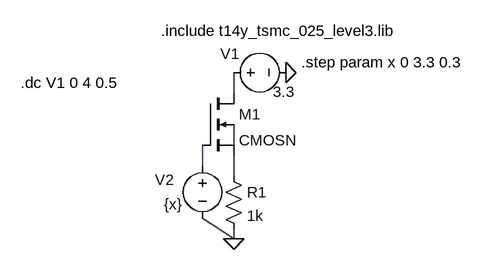
[diagram p0: schematic Draft5.asc]
Draft5.asc, the LTspice schematic file:
Version 4
SHEET 1 880 680
WIRE 176 128 176 96
WIRE 176 208 176 176
WIRE 128 240 128 208
WIRE 176 256 176 224
WIRE 176 352 128 320
WIRE 176 352 176 336
FLAG 176 352 0
FLAG 256 96 0
SYMBOL nmos4 128 128 R0
SYMATTR InstName M1
SYMATTR Value CMOSN
SYMATTR Value2 l=250n w=10u m=40
SYMBOL voltage 160 96 R270
WINDOW 0 13 10 VTop 2
WINDOW 3 -14 93 VBottom 2
WINDOW 123 0 0 Left 0
WINDOW 39 0 0 Left 0
SYMATTR InstName V1
SYMATTR Value 3.3
SYMBOL voltage 128 224 R0
WINDOW 0 -73 37 Left 2
WINDOW 3 -59 75 Left 2
WINDOW 123 0 0 Left 0
WINDOW 39 0 0 Left 0
SYMATTR InstName V2
SYMATTR Value {x}
SYMBOL res 160 240 R0
SYMATTR InstName R1
SYMATTR Value 1k
TEXT 64 32 Left 2 !.include t14y_tsmc_025_level3.lib
TEXT 280 80 Left 2 !.step param x 0 3.3 0.3
TEXT -152 112 Left 2 !.dc V1 0 4 0.5

The netlist it stands for:
* Draft5.asc
M1 N001 N003 N004 N002 CMOSN l=250n w=10u m=40
V1 N001 0 3.3
V2 N003 0 {x}
R1 N004 0 1k
.model NMOS NMOS
.model PMOS PMOS
.lib standard.mos
.include t14y_tsmc_025_level3.lib
.step param x 0 3.3 0.3
.dc V1 0 4 0.5
.backanno
.end